# EAGLE design ButterflyFC (EAGLE 9.0.0)
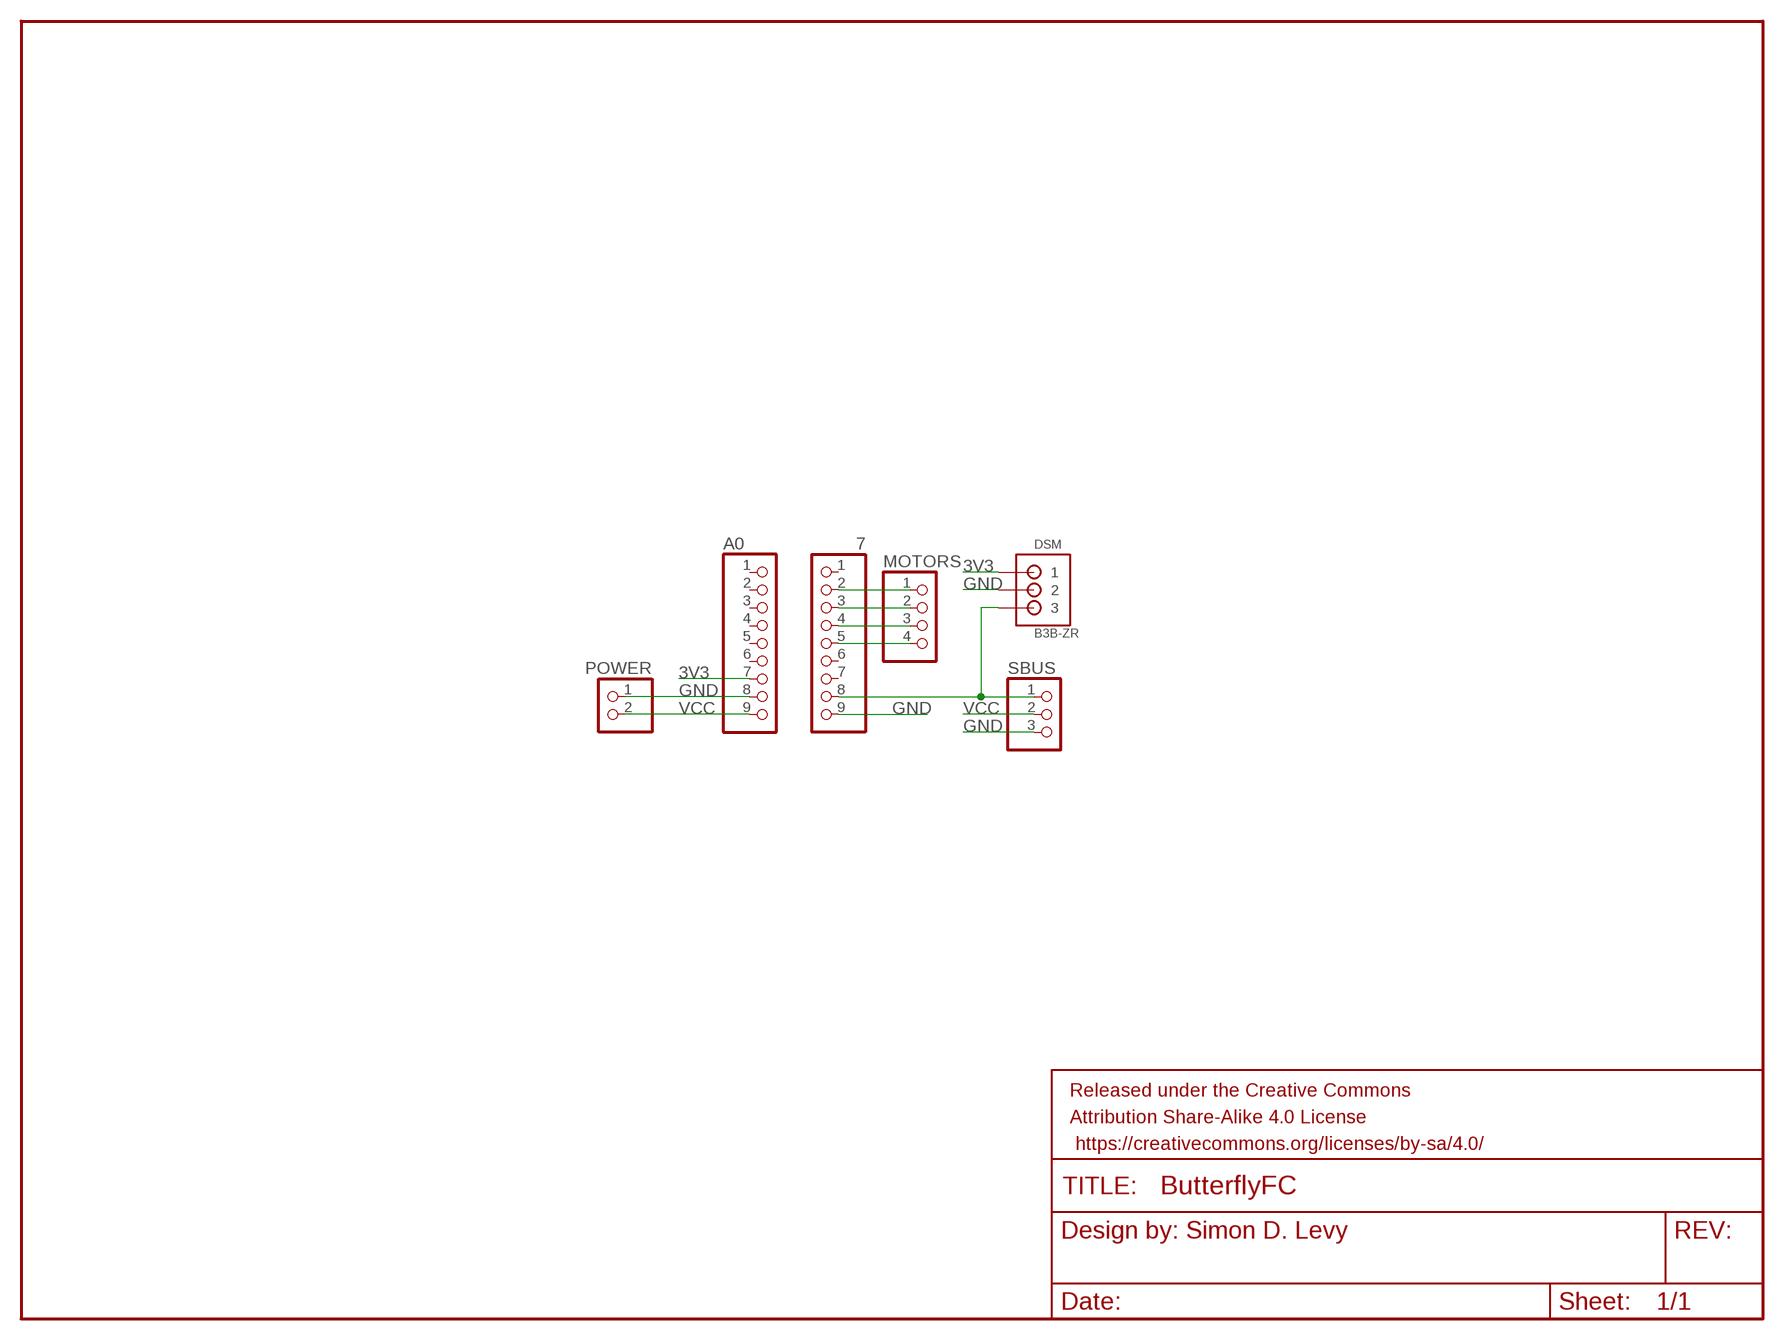
[diagram p0: schematic, sheet 1]

## Parts
7  PINHD-1X9  [1X09]
A0  PINHD-1X9  [1X09]
DSM  B3B-ZR  [B3B-ZR]
FRAME1  FRAME-LETTER  [CREATIVE_COMMONS]
MOTORS  PINHD-1X4  [1X04]
POWER  PINHD-1X2  [1X02]
SBUS  PINHD-1X3  [1X03]

## Nets
3V3: A0.7 DSM.1
GND: 7.9 A0.8 DSM.2 POWER.1 SBUS.3
M1: 7.5 MOTORS.4
M2: 7.4 MOTORS.3
M3: 7.3 MOTORS.2
M4: 7.2 MOTORS.1
RX1: 7.8 DSM.3 SBUS.1
VCC: A0.9 POWER.2 SBUS.2
Unconnected: 7.1 7.6 7.7 A0.1 A0.2 A0.3 A0.4 A0.5 A0.6

## Library data of the parts
7 A0 = pinhead:PINHD-1X9: PIN HEADER
DSM = jst:B3B-ZR: JST-ZH Connector 3 pol, 1.5mm pitch Package: B3B-ZR Source: http://www.jst-mfg.com/product/pdf/eng/eZH.pdf
FRAME1 = SparkFun-Aesthetics:FRAME-LETTER: Schematic Frame - Letter Standard 8.5x11 US Letter frame
MOTORS = pinhead:PINHD-1X4: PIN HEADER
POWER = pinhead:PINHD-1X2: PIN HEADER
SBUS = pinhead:PINHD-1X3: PIN HEADER

## Board
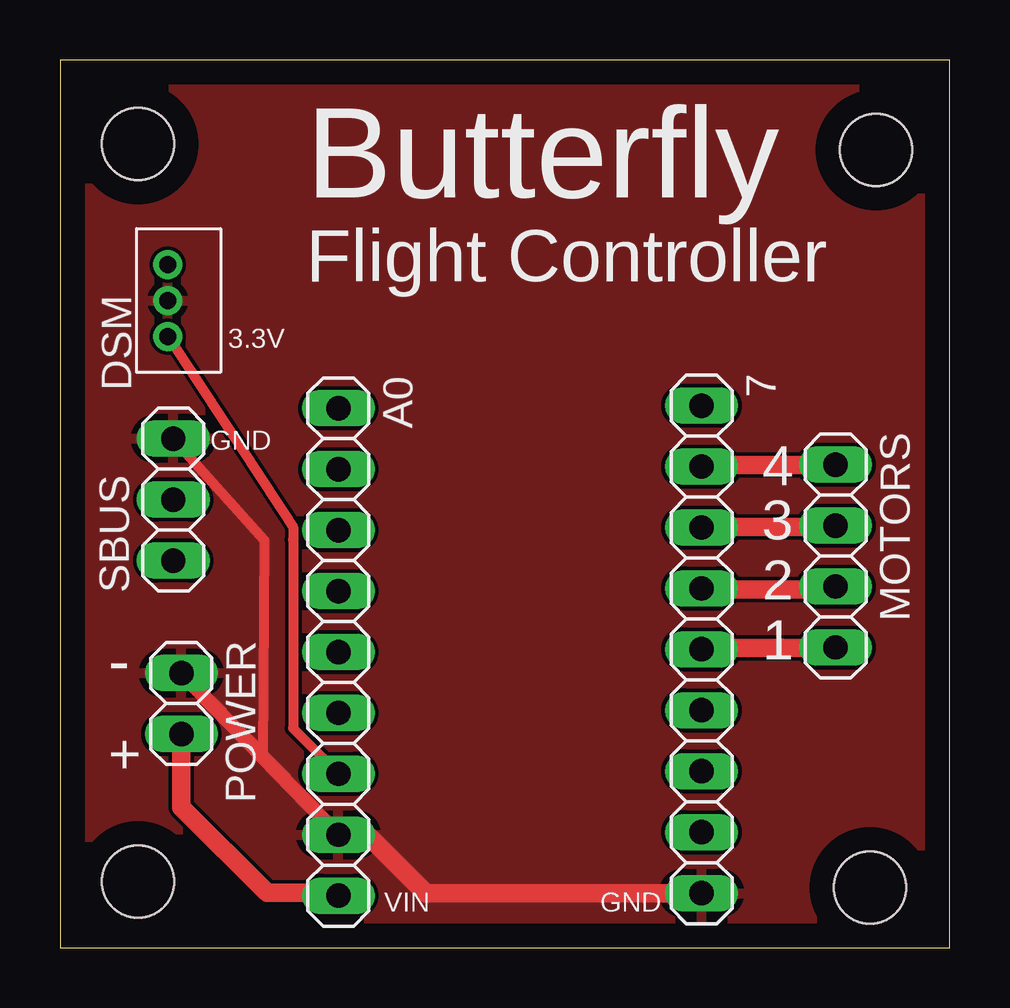
[diagram p1: board, top side]
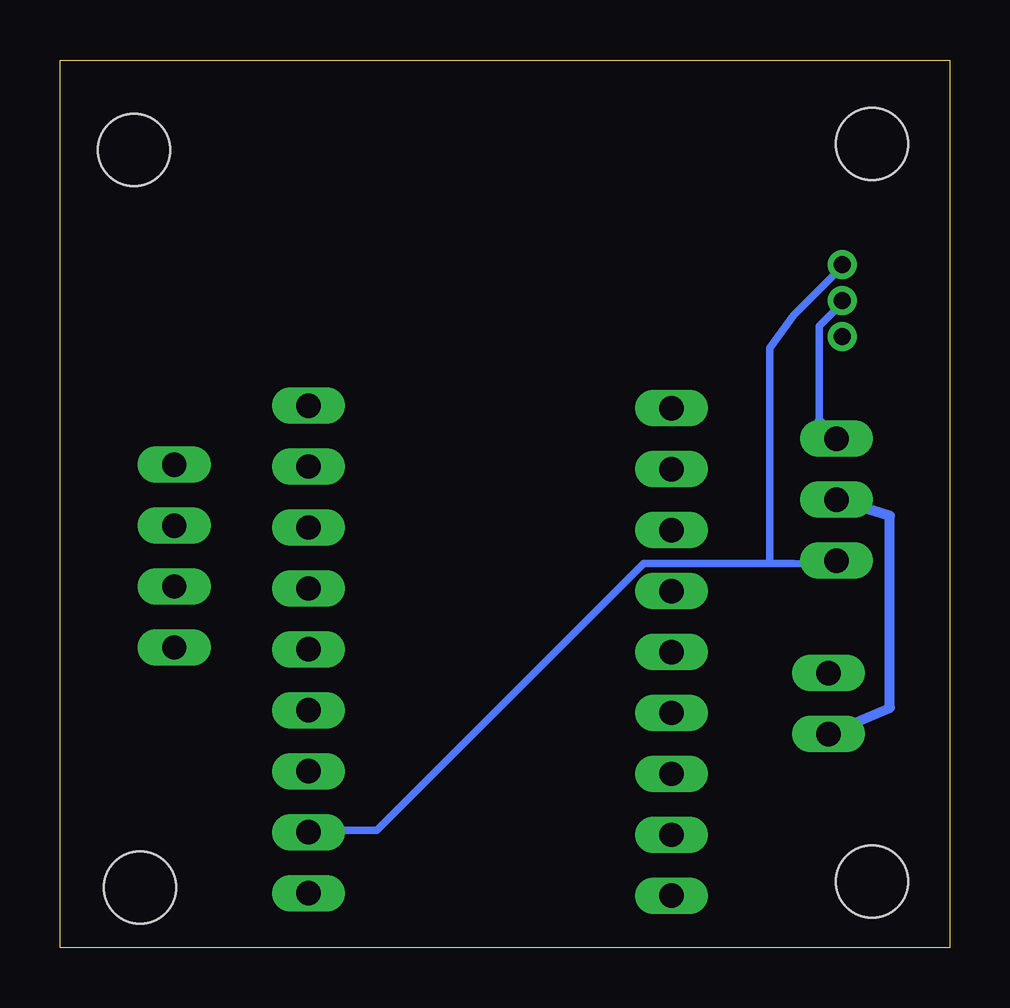
[diagram p2: board, bottom side, seen from below]

Size 37.08 x 37 mm. Coordinates in mm from the lower left corner, seen from the top.
Outline: 0,0 37.08,0 37.08,37 0,37 0,0
Copper layers (1*16): Top 0.035mm / dielectric 1.5mm / Bottom 0.035mm
Design rules "default": minimum track width 6mil, minimum drill 0.35mm, track to track 6mil, track to pad 6mil, pad to pad 6mil, via to via 6mil, smd to smd 6mil, copper to edge 40mil, drill to drill 6mil, minimum pad ring 10mil, minimum via ring 8mil, stop-mask expansion 4mil, vias tented up to drill 0mil, thermal gap 10mil
Holes 3 mm at 3.25,2.75 3.25,33.5 34,33.25 33.75,2.5

### Footprints (pad centres in the part's own frame; a part is rotated, then mirrored left to right if it is on the bottom)
1X09 = drill 1.016 long: 1 -10.16,0; 2 -7.62,0; 3 -5.08,0; 4 -2.54,0; 5 0,0; 6 2.54,0; 7 5.08,0; 8 7.62,0; 9 10.16,0
B3B-ZR = drill 0.7 pad 1.1: 1 -1.5,0; 2 0,0; 3 1.5,0
1X04 = drill 1.016 long: 1 -3.81,0; 2 -1.27,0; 3 1.27,0; 4 3.81,0
1X02 = drill 1.016 long: 1 -1.27,0; 2 1.27,0
1X03 = drill 1.016 long: 1 -2.54,0; 2 0,0; 3 2.54,0

### Placement (x,y rotation side)
7  26.73,12.43 270 top
A0  11.6,12.32 270 top
DSM  4.49,26.97 90 top
FRAME1  -7.51,-10.73 0 top  (outside the outline)
MOTORS  32.32,16.32 270 top
POWER  5.06,10.17 270 top
SBUS  4.72,18.67 90 top

### Tracks (layer width: path | path; a pad name or v marks a point on that pad's centre or on a via)
3V3
  Top 0.152: 11.54,7.32 A0.7 | DSM.1 4.53,25.45
  Top 0.305: 9.71,17
  Top 0.406: 11.54,7.32 9.71,9.14 9.71,17 9.71,17.53 4.53,25.45
GND
  Top 0.152: 26.48,2.29 7.9 | A0.8 11.9,5 | 4.83,21.18 SBUS.3
  Top 0.406: SBUS.3 8.5,17 8.45,7.95
  Top 0.61: POWER.1 8.45,7.95 A0.8
  Top 0.762: 7.9 15.23,2.27 12.5,5 11.9,5
  Bottom 0.152: 4.53,26.82 DSM.2 | 4.83,21.34 SBUS.3
  Bottom 0.305: 4.53,26.82 5.44,25.91 5.44,21.95
  Bottom 0.406: 4.83,21.34 5.44,21.95
  pour Top: 0.75,36.75 36.75,36.75 36.5,-0.25 0.5,-0.25
M1
  Top 0.152: 26.63,12.5 7.5 | 33.18,12.5 MOTORS.4
  Top 0.762: 33.18,12.5 26.63,12.5
M2
  Top 0.152: 26.63,14.94 7.4 | 33.18,14.94 MOTORS.3
  Top 0.762: 33.18,14.94 26.63,14.94
M3
  Top 0.152: 26.63,17.53 7.3 | 33.18,17.53 MOTORS.2
  Top 0.762: 33.18,17.53 26.63,17.53
M4
  Top 0.152: 26.63,20.12 7.2 | 33.18,20.12 MOTORS.1
  Top 0.762: 33.18,20.12 26.63,20.12
RX1
  Bottom 0.152: 26.48,4.88 7.8 | 4.53,28.35 DSM.3
  Bottom 0.305: 26.48,4.88 23.88,4.88 12.76,16 9.5,16 7.5,16 | 7.5,16 6.51,16 5.5,16 SBUS.1 | 4.53,28.35 6.51,26.36 7.5,25 7.5,16
VCC
  Top 0.152: 11.54,2.29 A0.9
  Top 0.762: 11.54,2.29 8.62,2.29 5.06,5.85 POWER.2
  Bottom 0.406: POWER.2 2.5,10 2.5,18 SBUS.2

### Text on the board
tPlace: Butterfly | Flight Controller | 3.3V | GND | 4 | 3 | 2 | 1 | - | + | VIN | GND